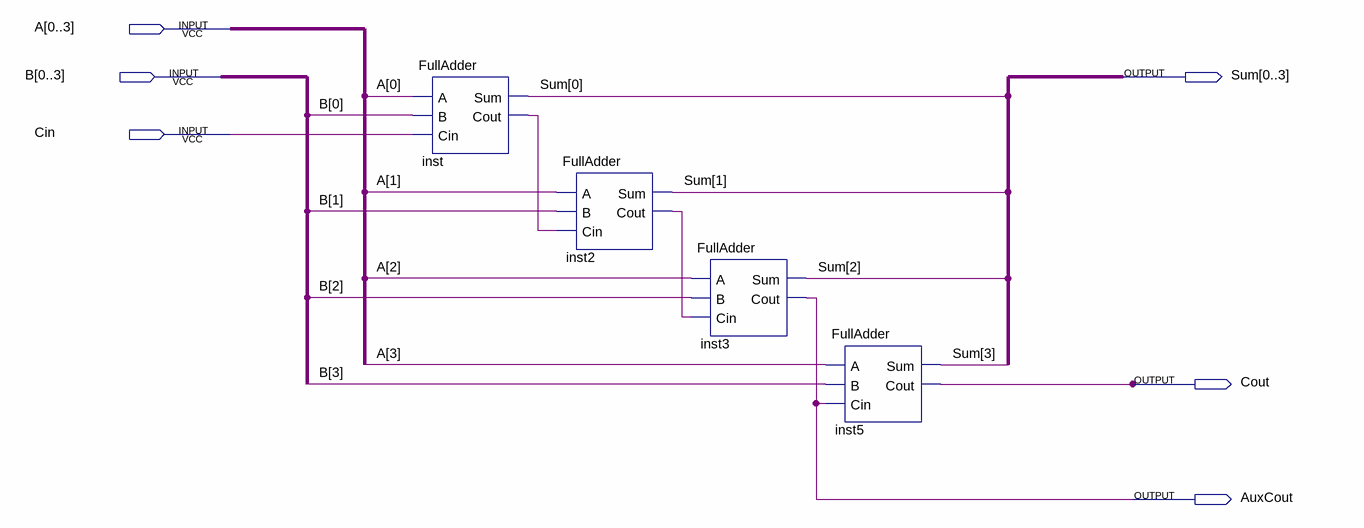
[diagram p0: schematic sheet]
// Quartus schematic FullAdder4Bit.bdf as structural Verilog: 4 symbols, 6 pins
module FullAdder4Bit (
  input  [0:3] A,
  input  [0:3] B,
  input  Cin,
  output [0:3] Sum,
  output Cout,
  output AuxCout
);

  wire inst2_cout, inst_cout;

  FullAdder inst (.A(A[0]), .B(B[0]), .Cin(Cin), .Sum(Sum[0]), .Cout(inst_cout));
  FullAdder inst2 (.A(A[1]), .B(B[1]), .Cin(inst_cout), .Sum(Sum[1]), .Cout(inst2_cout));
  FullAdder inst3 (.A(A[2]), .B(B[2]), .Cin(inst2_cout), .Sum(Sum[2]), .Cout(AuxCout));
  FullAdder inst5 (.A(A[3]), .B(B[3]), .Cin(AuxCout), .Sum(Sum[3]), .Cout(Cout));
endmodule
